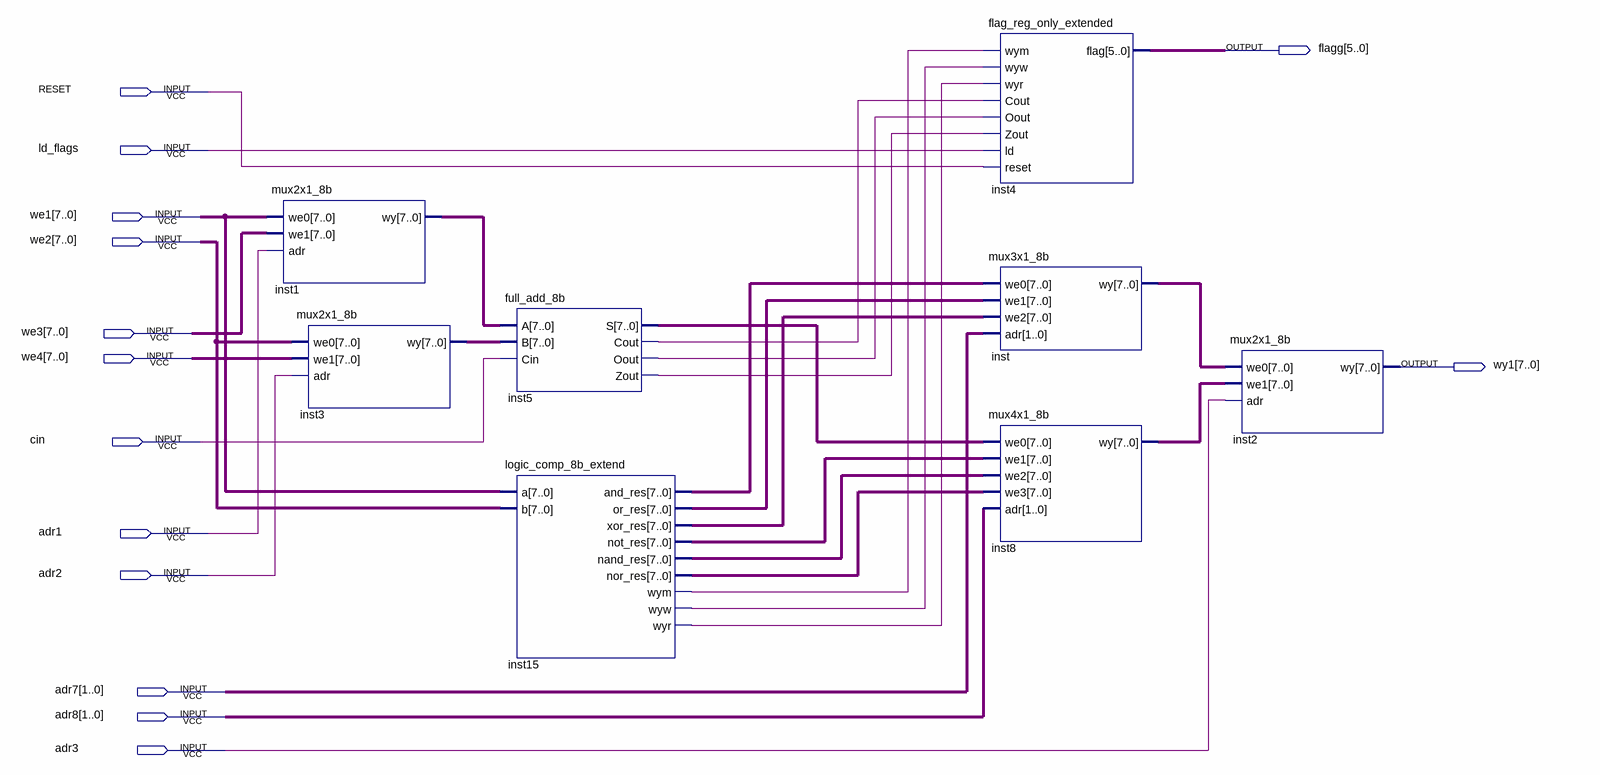
[diagram p0: schematic sheet]
// Quartus schematic ASK_6.bdf as structural Verilog: 8 symbols, 14 pins
module ASK_6 (
  input  RESET,
  input  ld_flags,
  input  [7:0] we1,
  input  [7:0] we2,
  input  [7:0] we3,
  input  [7:0] we4,
  input  cin,
  input  adr1,
  input  adr2,
  input  [1:0] adr7,
  input  [1:0] adr8,
  input  adr3,
  output [5:0] flagg,
  output [7:0] wy1
);

  wire inst5_cout, inst5_oout, inst5_zout, inst15_wym, inst15_wyr, inst15_wyw;
  wire [7:0] inst1_wy, inst3_wy, inst5_s, inst8_wy, inst15_and_res, inst15_nand_res, inst15_nor_res,
       inst15_not_res, inst15_or_res, inst15_xor_res, inst_wy;

  mux2x1_8b inst1 (.we0(we1), .we1(we3), .adr(adr1), .wy(inst1_wy));
  mux2x1_8b inst3 (.we0(we2), .we1(we4), .adr(adr2), .wy(inst3_wy));
  full_add_8b inst5 (
    .A(inst1_wy), .B(inst3_wy), .Cin(cin), .S(inst5_s), .Cout(inst5_cout), .Oout(inst5_oout),
    .Zout(inst5_zout));
  logic_comp_8b_extend inst15 (
    .a(we1), .b(we2), .and_res(inst15_and_res), .or_res(inst15_or_res), .xor_res(inst15_xor_res),
    .not_res(inst15_not_res), .nand_res(inst15_nand_res), .nor_res(inst15_nor_res), .wym(inst15_wym),
    .wyw(inst15_wyw), .wyr(inst15_wyr));
  flag_reg_only_extended inst4 (
    .wym(inst15_wym), .wyw(inst15_wyw), .wyr(inst15_wyr), .Cout(inst5_cout), .Oout(inst5_oout),
    .Zout(inst5_zout), .ld(ld_flags), .reset(RESET), .flag(flagg));
  mux3x1_8b inst (.we0(inst15_and_res), .we1(inst15_or_res), .we2(inst15_xor_res), .adr(adr7), .wy(inst_wy));
  mux4x1_8b inst8 (
    .we0(inst5_s), .we1(inst15_not_res), .we2(inst15_nand_res), .we3(inst15_nor_res), .adr(adr8),
    .wy(inst8_wy));
  mux2x1_8b inst2 (.we0(inst_wy), .we1(inst8_wy), .adr(adr3), .wy(wy1));
endmodule
